# EAGLE design volume1882 (EAGLE 7.6.0)
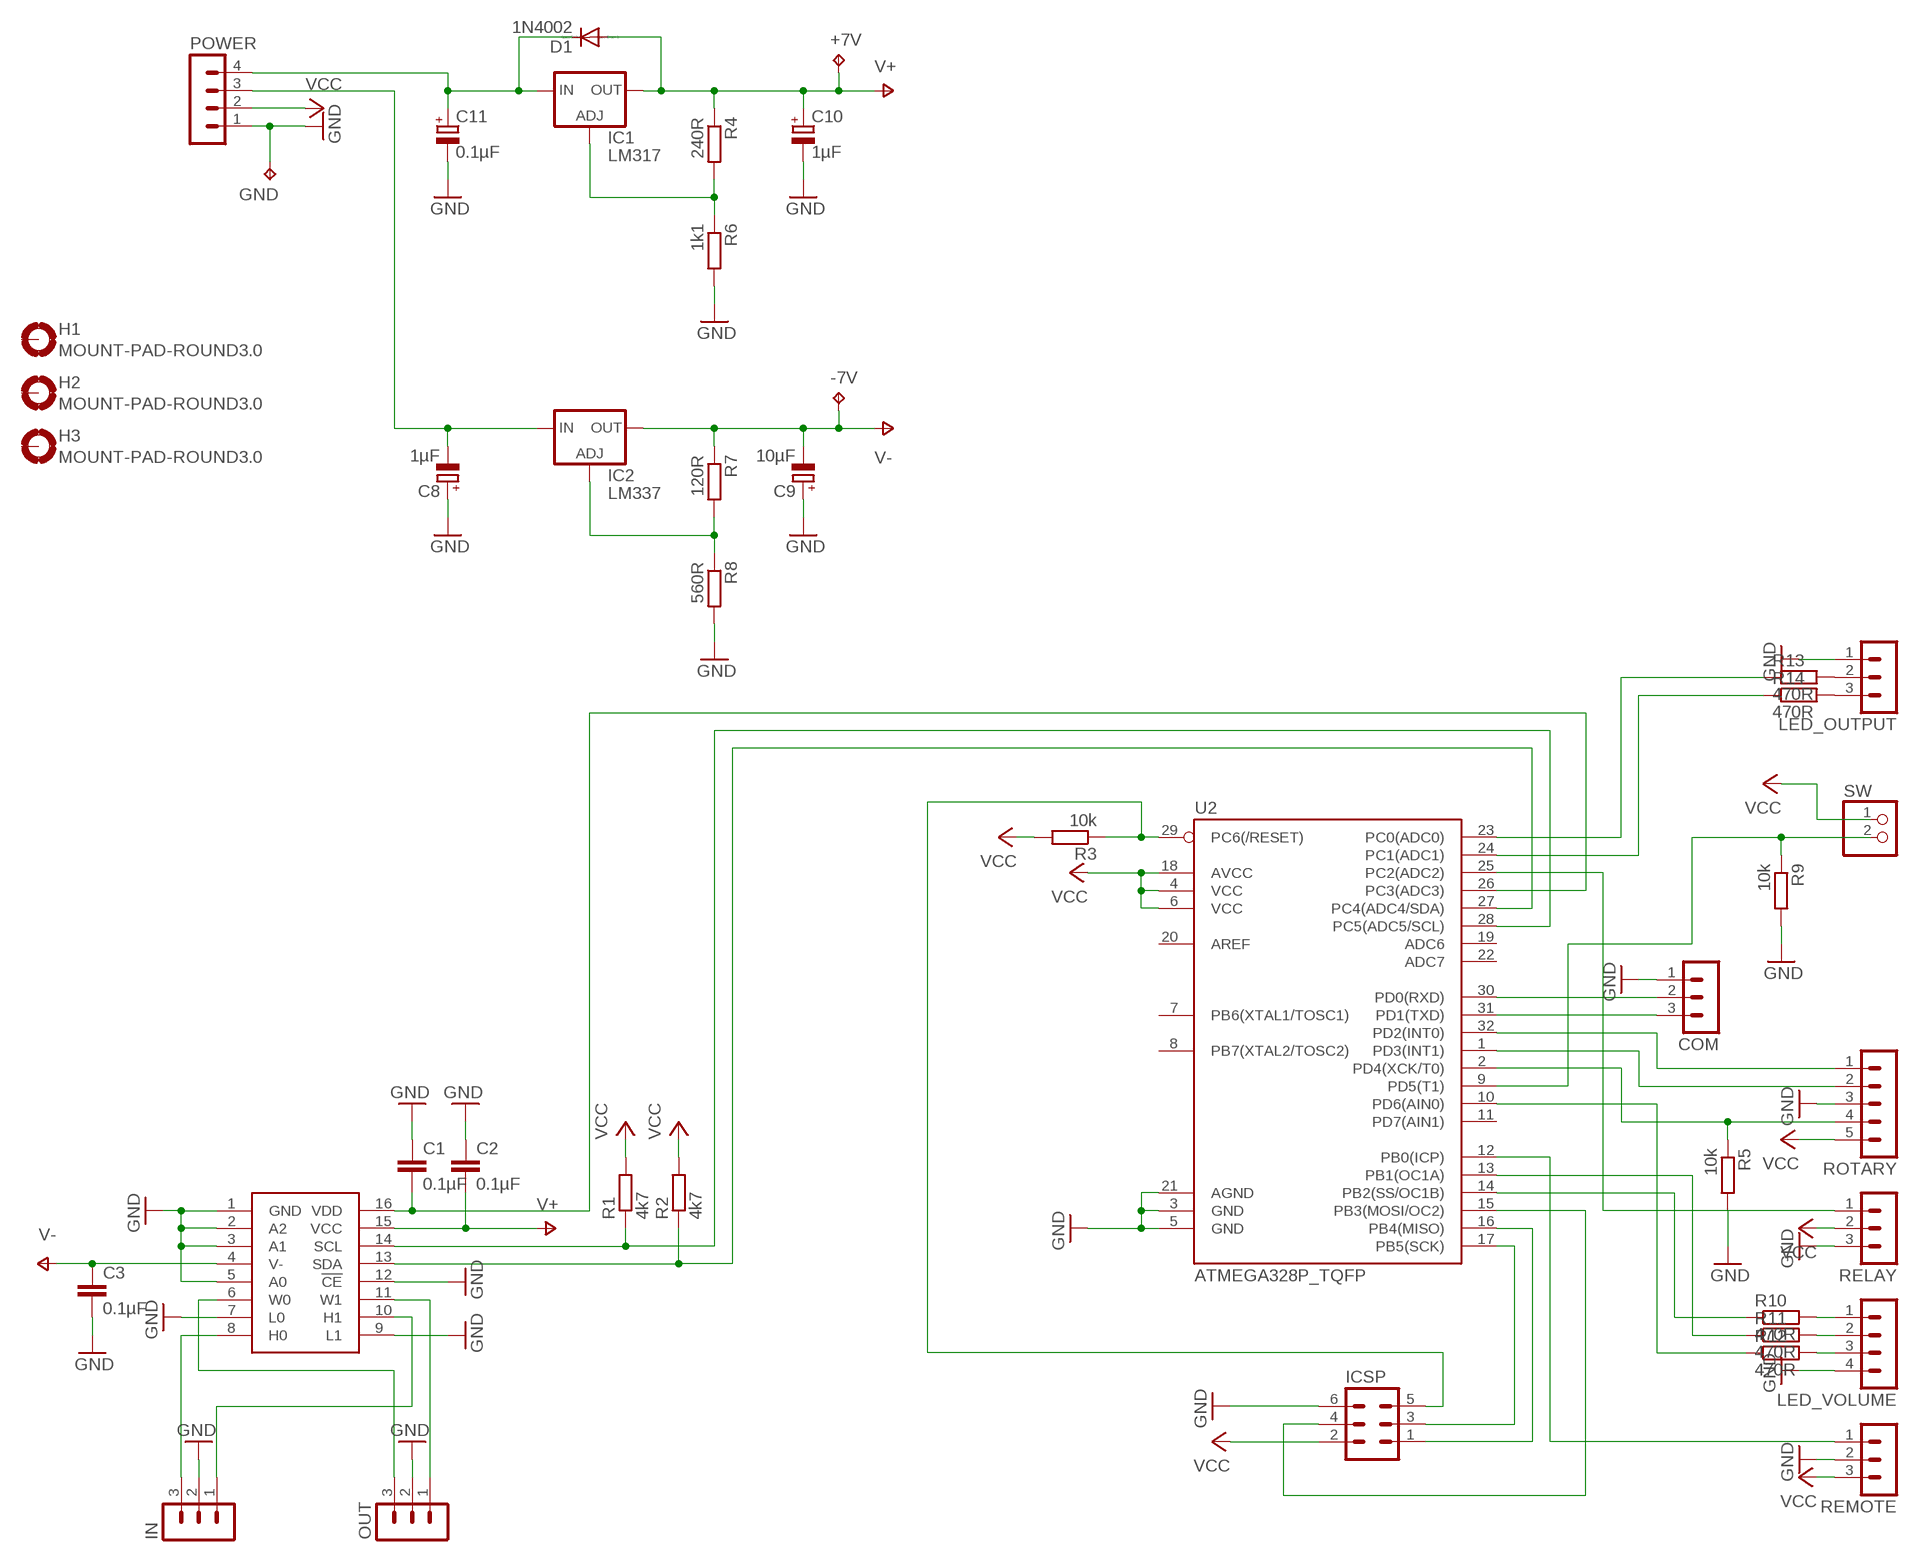
[diagram p0: schematic, sheet 1]

## Parts
+7V  TPTP12SQ  [TP12SQ]
-7V  TPTP12SQ  [TP12SQ]
C1  0.1µF  C-EUC1206  [C1206]
C2  0.1µF  C-EUC1206  [C1206]
C3  0.1µF  C-EUC1206  [C1206]
C8  1µF  CPOL-EUE2-5  [E2-5]
C9  10µF  CPOL-EUE2-5  [E2-5]
C10  1µF  CPOL-EUE2-5  [E2-5]
C11  0.1µF  CPOL-EUE2-5  [E2-5]
COM  MA03-1  [MA03-1]
D1  1N4002  1N4004  [DO41-10]
GND  TPTP12SQ  [TP12SQ]
H1  MOUNT-PAD-ROUND3.0  [3,0-PAD]
H2  MOUNT-PAD-ROUND3.0  [3,0-PAD]
H3  MOUNT-PAD-ROUND3.0  [3,0-PAD]
IC1  LM317  LM317MBSTT3  [SOT223]
IC2  LM337  [SOT223]
ICSP  MA03-2  [MA03-2]
IN  MA03-1  [MA03-1]
LED_OUTPUT  MA03-1  [MA03-1]
LED_VOLUME  MA04-1  [MA04-1]
OUT  MA03-1  [MA03-1]
POWER  MA04-1  [MA04-1]
R1  4k7  R-EU_R1206  [R1206]
R2  4k7  R-EU_R1206  [R1206]
R3  10k  R-EU_R1206  [R1206]
R4  240R  R-EU_R1206  [R1206]
R5  10k  R-EU_R1206  [R1206]
R6  1k1  R-EU_R1206  [R1206]
R7  120R  R-EU_R1206  [R1206]
R8  560R  R-EU_R1206  [R1206]
R9  10k  R-EU_R1206  [R1206]
R10  470R  R-EU_R1206  [R1206]
R11  470R  R-EU_R1206  [R1206]
R12  470R  R-EU_R1206  [R1206]
R13  470R  R-EU_R1206  [R1206]
R14  470R  R-EU_R1206  [R1206]
RELAY  MA03-1  [MA03-1]
REMOTE  MA03-1  [MA03-1]
ROTARY  MA05-1  [MA05-1]
SW  PINHD-1X2  [1X02]
U1  DS1882  [SO16]
U2  ATMEGA328P_TQFP  [TQFP32-08]

## Nets
GND: C1.1 C2.1 C3.2 C8.+ C9.+ C10.- C11.- COM.1 GND.TP ICSP.6 IN.2 LED_OUTPUT.1 LED_VOLUME.4 OUT.2 POWER.1 R5.2 R6.2 R8.2 R9.2 RELAY.3 REMOTE.2 ROTARY.3 U1.1(GND) U1.2(A2) U1.3(A1) U1.5(A0) U1.7(L0) U1.9(L1) U1.12(!CE) U2.3(GND) U2.5(GND) U2.21(AGND)
N$1: ICSP.5 R3.1 U2.29(PC6(/RESET))
N$2: ICSP.1 U2.16(PB4(MISO))
N$3: ICSP.3 U2.17(PB5(SCK))
N$4: ICSP.4 U2.15(PB3(MOSI/OC2))
N$5: R1.1 U1.14(SCL) U2.28(PC5(ADC5/SCL))
N$6: R2.1 U1.13(SDA) U2.27(PC4(ADC4/SDA))
N$7: COM.3 U2.31(PD1(TXD))
N$8: COM.2 U2.30(PD0(RXD))
N$9: ROTARY.1 U2.32(PD2(INT0))
N$10: ROTARY.2 U2.1(PD3(INT1))
N$11: R5.1 ROTARY.4 U2.2(PD4(XCK/T0))
N$12: C1.2 U1.16(VDD) U2.26(PC3(ADC3))
N$13: R11.1 U2.13(PB1(OC1A))
N$14: R10.1 U2.14(PB2(SS/OC1B))
N$15: R12.1 U2.10(PD6(AIN0))
N$16: IN.3 U1.8(H0)
N$17: IN.1 U1.10(H1)
N$18: OUT.3 U1.6(W0)
N$19: OUT.1 U1.11(W1)
N$20: C11.+ D1.C IC1.3(IN) POWER.4
N$21: C8.- IC2.2(IN) POWER.3
N$22: IC1.1(ADJ) R4.2 R6.1
N$23: R9.1 SW.2 U2.9(PD5(T1))
N$24: IC2.1(ADJ) R7.2 R8.1
N$25: RELAY.1 U2.25(PC2(ADC2))
N$26: LED_VOLUME.1 R10.2
N$27: LED_VOLUME.2 R11.2
N$28: LED_VOLUME.3 R12.2
N$29: R13.1 U2.23(PC0(ADC0))
N$30: R14.1 U2.24(PC1(ADC1))
N$31: LED_OUTPUT.2 R13.2
N$32: LED_OUTPUT.3 R14.2
N$33: REMOTE.1 U2.12(PB0(ICP))
V+: +7V.TP C2.2 C10.+ D1.A IC1.4(OUT) R4.1 U1.15(VCC)
V-: -7V.TP C3.1 C9.- IC2.3(OUT) R7.1 U1.4(V-)
VCC: ICSP.2 POWER.2 R1.2 R2.2 R3.2 RELAY.2 REMOTE.3 ROTARY.5 SW.1 U2.4(VCC) U2.6(VCC) U2.18(AVCC)
Unconnected: H1.B3,0(MOUNT) H2.B3,0(MOUNT) H3.B3,0(MOUNT) U2.7(PB6(XTAL1/TOSC1)) U2.8(PB7(XTAL2/TOSC2)) U2.11(PD7(AIN1)) U2.19(ADC6) U2.20(AREF) U2.22(ADC7)

## Library data of the parts
+7V -7V GND = testpad:TP: Test pad
C1-C3 = resistor:C-EU: CAPACITOR, European symbol
C8-C11 = resistor:CPOL-EU: POLARIZED CAPACITOR, European symbol
COM IN LED_OUTPUT OUT RELAY REMOTE = con-lstb:MA03-1: PIN HEADER; OC_FARNELL: unknown; OC_NEWARK: unknown
D1 = diode:1N4004: DIODE general purpose rectifier, 1 A
H1-H3 = holes:MOUNT-PAD-ROUND: MOUNTING PAD, round
IC1 = v-reg:LM317?*: 500 mA Adjustable Output Positive Voltage Regulator Source: http://www.onsemi.co.jp .. LM317M-D.PDF
IC2 = lm337:LM337
ICSP = con-lstb:MA03-2: PIN HEADER; OC_FARNELL: unknown; OC_NEWARK: unknown
LED_VOLUME POWER = con-lstb:MA04-1: PIN HEADER; OC_FARNELL: unknown; OC_NEWARK: unknown
R1-R14 = resistor:R-EU_: RESISTOR, European symbol
ROTARY = con-lstb:MA05-1: PIN HEADER; OC_FARNELL: unknown; OC_NEWARK: unknown
SW = pinhead:PINHD-1X2: PIN HEADER
U1 = ds1882:DS1882
U2 = SparkFun-DigitalIC:ATMEGA328P_TQFP; PROD_ID: IC-09069

## Board
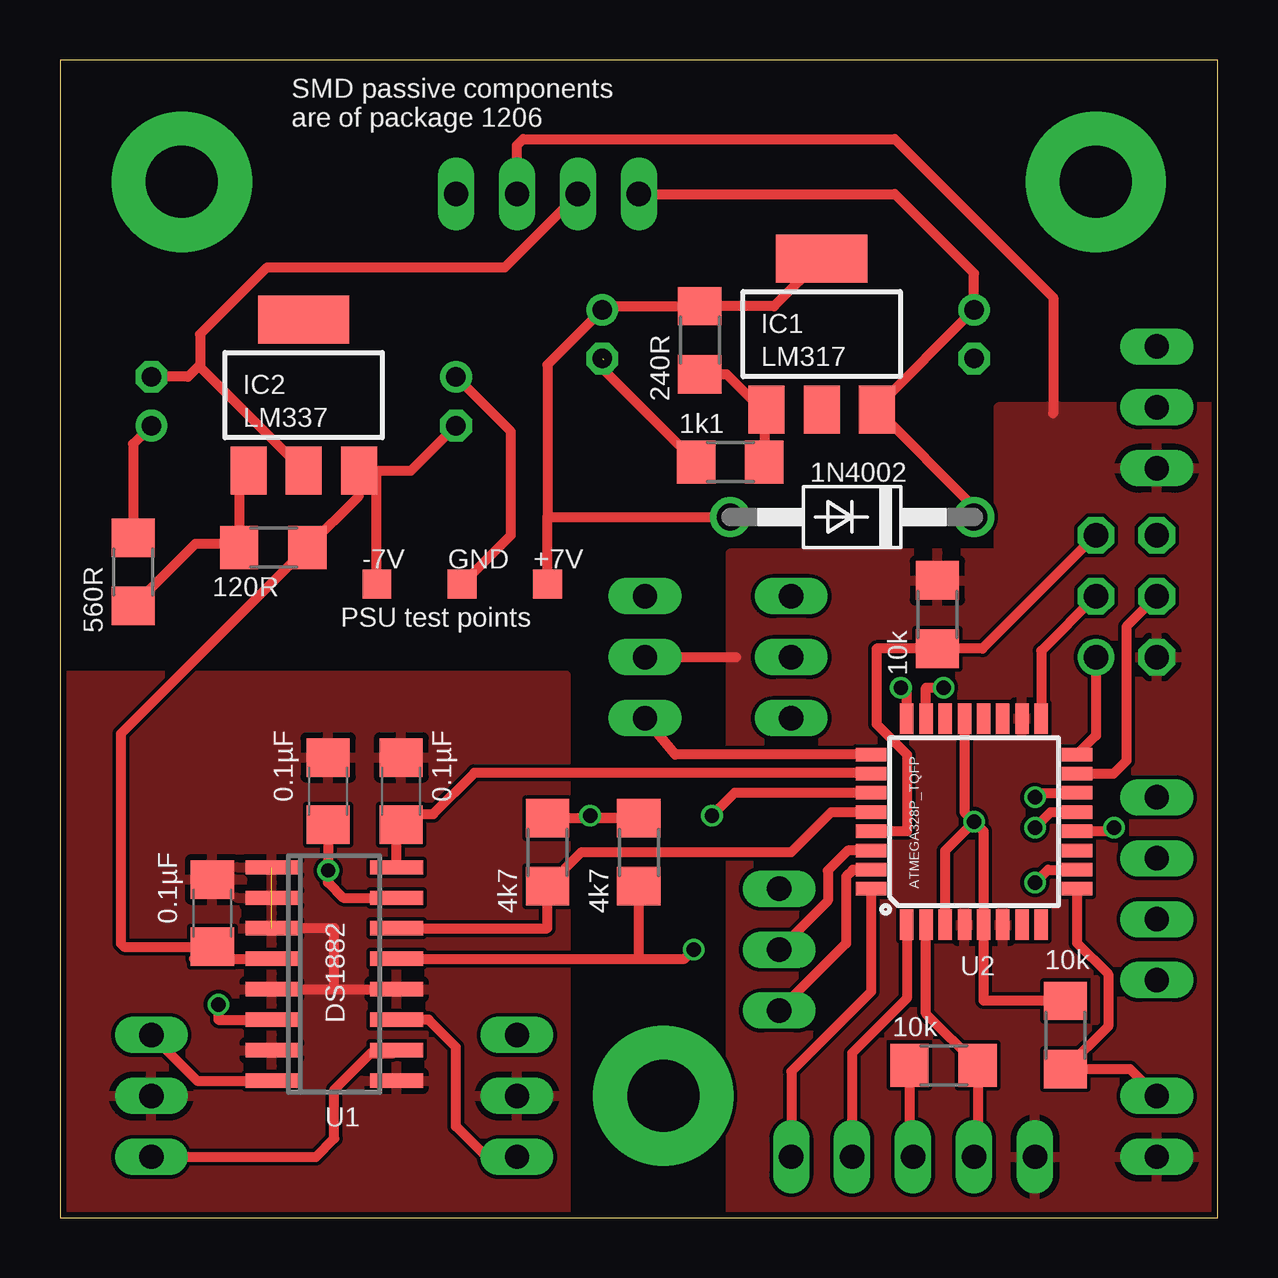
[diagram p1: board, top side]
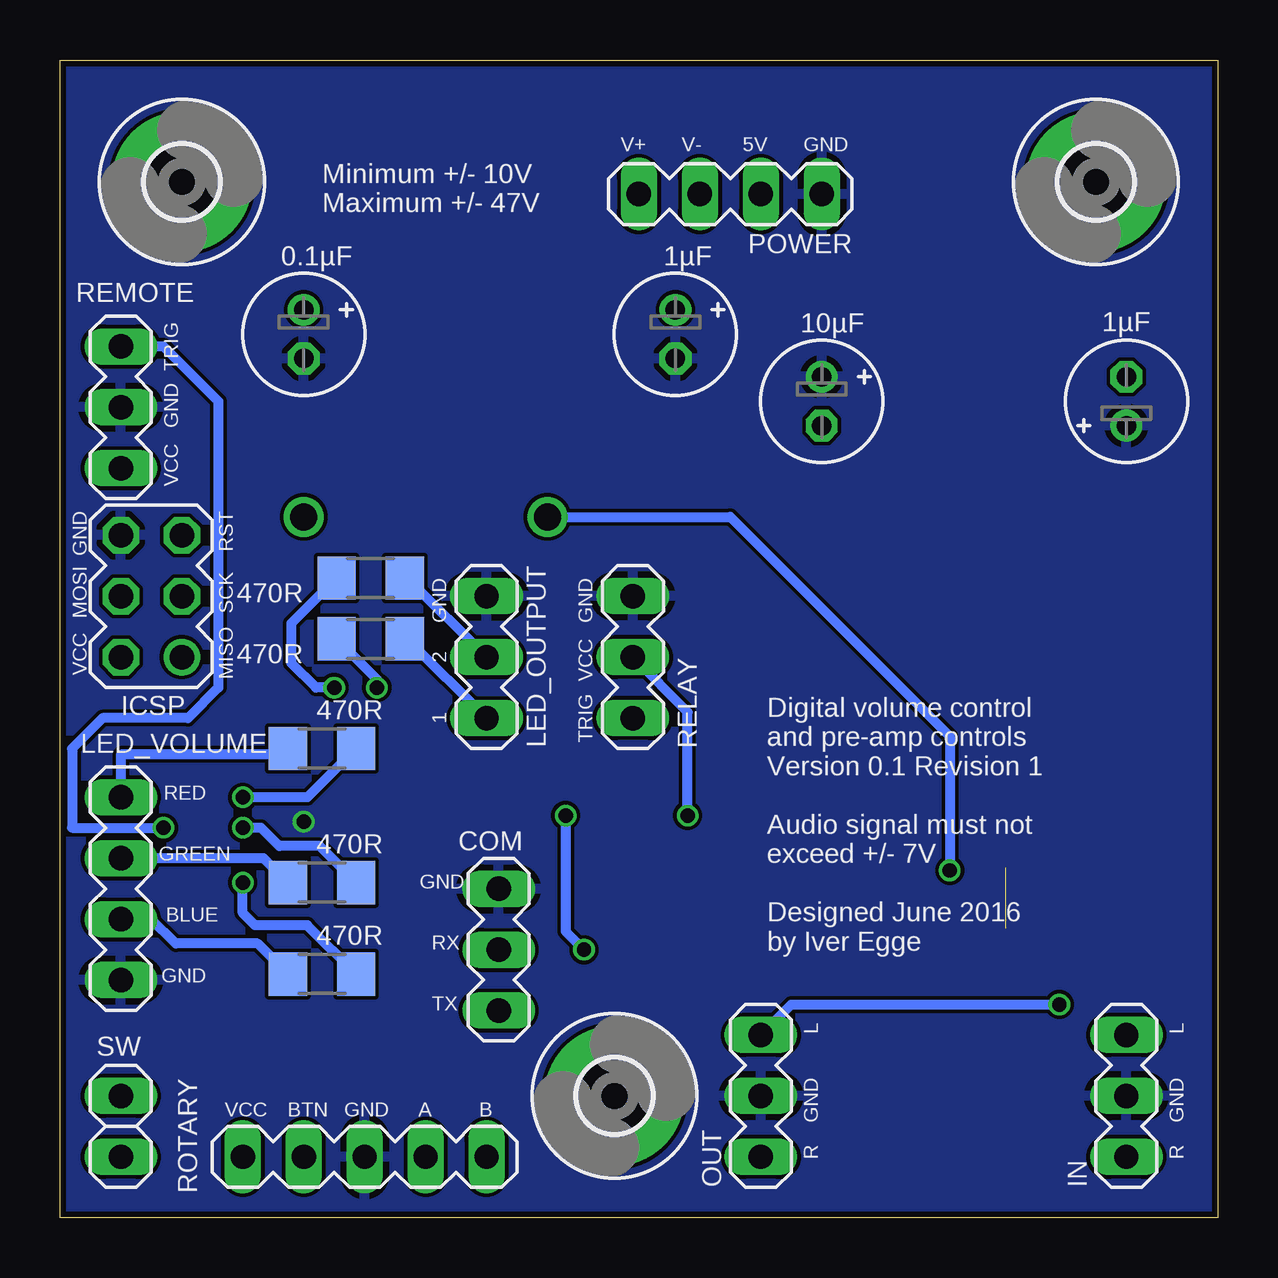
[diagram p2: board, bottom side, seen from below]

Size 48.26 x 48.26 mm. Coordinates in mm from the lower left corner, seen from the top.
Outline: 0,0 48.26,0 48.26,48.26 0,48.26 0,0
Copper layers (1*16): Top 0.035mm / dielectric 1.5mm / Bottom 0.035mm
Design rules "SeeedStudio_2layer_DRU_no_angle_20140221": minimum track width 6mil, minimum drill 12mil, track to track 6mil, track to pad 6mil, pad to pad 6mil, via to via 6mil, smd to smd 0mil, copper to edge 10mil, drill to drill 10mil, minimum pad ring 10mil, minimum via ring 6mil, stop-mask expansion 2mil, vias tented up to drill 100mil, thermal gap 10mil

### Footprints (pad centres in the part's own frame; a part is rotated, then mirrored left to right if it is on the bottom)
TP12SQ = smd 1.2 x 1.2: TP 0,0
C1206 = smd 1.6 x 1.8: 1 -1.4,0; 2 1.4,0
E2-5 = drill 0.813 pad 1.27: + -1.016,0 | drill 0.813 pad 1.27 octagon: - 1.016,0
MA03-1 = drill 1.016 long: 1 -2.54,0; 2 0,0; 3 2.54,0
DO41-10 = drill 1.118: A 5.08,0; C -5.08,0
3,0-PAD = drill 3 pad 5.842: B3,0 0,0
SOT223 = smd 1.5 x 2: 1 -2.3,-3.15; 2 0,-3.15; 3 2.3,-3.15 | smd 3.8 x 2: 4 0,3.15
MA03-2 = drill 1.016: 1 -2.54,-1.27 | drill 1.016 octagon: 2 -2.54,1.27; 3 0,-1.27; 4 0,1.27; 5 2.54,-1.27; 6 2.54,1.27
MA04-1 = drill 1.016 long: 1 -3.81,0; 2 -1.27,0; 3 1.27,0; 4 3.81,0
R1206 = smd 1.6 x 1.803: 1 -1.422,0; 2 1.422,0
MA05-1 = drill 1.016 long: 1 -5.08,0; 2 -2.54,0; 3 0,0; 4 2.54,0; 5 5.08,0
1X02 = drill 1.016 long: 1 -1.27,0; 2 1.27,0
SO16 = smd 0.6 x 2.2: 1 -4.445,-2.6; 2 -3.175,-2.6; 3 -1.905,-2.6; 4 -0.635,-2.6; 5 0.635,-2.6; 6 1.905,-2.6; 7 3.175,-2.6; 8 4.445,-2.6; 9 4.445,2.6; 10 3.175,2.6; 11 1.905,2.6; 12 0.635,2.6; 13 -0.635,2.6; 14 -1.905,2.6; 15 -3.175,2.6; 16 -4.445,2.6
TQFP32-08 = smd 1.27 x 0.559: 1 -4.293,2.8; 2 -4.293,2; 3 -4.293,1.2; 4 -4.293,0.4; 5 -4.293,-0.4; 6 -4.293,-1.2; 7 -4.293,-2; 8 -4.293,-2.8; 17 4.293,-2.8; 18 4.293,-2; 19 4.293,-1.2; 20 4.293,-0.4; 21 4.293,0.4; 22 4.293,1.2; 23 4.293,2; 24 4.293,2.8 | smd 0.559 x 1.27: 9 -2.8,-4.293; 10 -2,-4.293; 11 -1.2,-4.293; 12 -0.4,-4.293; 13 0.4,-4.293; 14 1.2,-4.293; 15 2,-4.293; 16 2.8,-4.293; 25 2.8,4.293; 26 2,4.293; 27 1.2,4.293; 28 0.4,4.293; 29 -0.4,4.293; 30 -1.2,4.293; 31 -2,4.293; 32 -2.8,4.293

### Placement (x,y rotation side)
+7V  20.32,26.42 0 top
-7V  13.21,26.42 0 top
C1  14.22,17.78 270 top
C2  11.18,17.78 270 top
C3  6.35,12.7 90 top
C8  3.81,34.04 90 bottom
C9  16.51,34.04 270 bottom
C10  22.61,36.83 270 bottom
C11  38.1,36.83 270 bottom
COM  29.97,11.18 270 bottom
D1  33.02,29.21 180 top
GND  16.76,26.42 0 top
H1  25.15,5.08 0 bottom
H2  43.18,43.18 0 bottom
H3  5.08,43.18 0 bottom
IC1  31.75,36.83 0 top
IC2  10.16,34.29 0 top
ICSP  44.45,25.91 90 bottom
IN  3.81,5.08 90 bottom
LED_OUTPUT  30.48,23.37 270 bottom
LED_VOLUME  45.72,13.72 270 bottom
OUT  19.05,5.08 90 bottom
POWER  20.32,42.67 180 bottom
R1  20.32,15.24 90 top
R2  24.13,15.24 90 top
R3  36.58,25.15 90 top
R4  26.67,36.58 270 top
R5  36.83,6.35 180 top
R6  27.94,31.5 180 top
R7  8.89,27.94 180 top
R8  3.05,26.92 90 top
R9  41.91,7.62 90 top
R10  37.34,19.56 180 bottom
R11  37.34,13.97 180 bottom
R12  37.34,10.16 180 bottom
R13  35.31,26.67 0 bottom
R14  35.31,24.13 0 bottom
RELAY  24.38,23.37 90 bottom
REMOTE  45.72,33.78 270 bottom
ROTARY  35.56,2.54 180 bottom
SW  45.72,3.81 90 bottom
U1  11.43,10.16 270 top
U2  38.1,16.51 90 top

### Tracks (layer width: path | path; a pad name or v marks a point on that pad's centre or on a via)
GND  (via drill 0.6 pad 0.25)  (2 unrouted)
  Top 0.406: U1.5 11.43,9.53 | 11.43,9.53 11.43,12.06 U1.3 | 11.43,9.53 U1.12 | U2.21 37.7,16.91 v38.1,16.51 | v38.1,16.51 38.5,16.11 U2.5 38.5,9.04 R9.2 | U2.3 36.9,15.31 v38.1,16.51 | R5.2 35.41,2.69 ROTARY.3 | GND.TP 18.8,28.45 18.8,32.77 C9.+ | C8.+ 3.05,32.26 R8.2 | 22.66,35.76 22.66,35.36 R6.2
  pour Bottom: 0,0 48.26,0 48.26,48.26 0,48.26
  pour Top: 0,22.61 21.08,22.61 21.08,-0.25 0,-0.25
N$1
  Top 0.406: U2.29 35.31,16.11 35.31,19.3 34.04,20.57 34.04,23.72 R3.1 38.46,23.72 ICSP.5
N$2
  Top 0.406: ICSP.1 43.18,20.1 U2.16
N$3
  Top 0.406: ICSP.3 40.9,23.63 U2.17
N$4
  Top 0.406: ICSP.4 44.45,24.64 44.45,19.05 43.91,18.51 U2.15
N$5
  Top 0.406: U1.14 20.32,12.06 R1.1 21.74,15.24 30.48,15.24 32.15,16.91 U2.28
N$6  (via drill 0.6 pad 0.25)
  Top 0.406: U1.13 24.13,10.79 | 24.13,10.79 R2.1 | U2.27 28.12,17.71 v27.18,16.76 | 24.13,10.79 26.04,10.79 v26.42,11.18
  Bottom 0.406: v27.18,16.76 27.18,11.94 v26.42,11.18
N$7
  Top 0.406: U2.31 33.05,14.51 32.77,14.22 32.77,11.43 COM.3
N$8
  Top 0.406: U2.30 32.84,15.31 32,14.48 32,13.21 COM.2
N$9
  Top 0.406: U2.32 33.81,9.42 30.48,6.1 ROTARY.1
N$10
  Top 0.406: U2.1 35.3,9.14 33.02,6.86 ROTARY.2
N$11
  Top 0.406: U2.2 36.1,8.5 R5.1 38.25,2.69 ROTARY.4
N$12
  Top 0.406: U2.26 33.77,18.54 17.27,18.54 15.56,16.83 14.03,16.83 arc90 C1.2 14.03,16.19 U1.16
N$13  (via drill 0.6)
  Top 0.406: v40.64,16.26 41.29,16.91 U2.13
  Bottom 0.406: R11.1 37.44,15.49 39.12,15.49 39.88,16.26 v40.64,16.26
N$14  (via drill 0.6 pad 0.25)
  Top 0.406: v40.64,17.53 40.82,17.71 U2.14
  Bottom 0.406: R10.1 37.95,17.53 v40.64,17.53
N$15  (via drill 0.6)
  Top 0.406: v40.64,13.97 41.18,14.51 U2.10
  Bottom 0.406: R12.1 37.95,12.19 40.13,12.19 40.64,12.7 v40.64,13.97
N$16
  Top 0.406: IN.3 5.71,5.71 U1.8
N$17
  Top 0.406: U1.10 13.9,6.86 12.95,6.86 11.43,5.33 11.43,3.3 10.67,2.54 IN.1
N$18  (via drill 0.6 pad 0.25)
  Top 0.406: U1.6 6.6,8.26 v6.6,8.89
  Bottom 0.406: OUT.3 17.78,8.89 v6.6,8.89
N$19
  Top 0.406: OUT.1 17.78,2.54 16.51,3.81 16.51,7.11 15.37,8.26 U1.11
N$20
  Top 0.406: D1.C 38.1,29.63 IC1.3 34.05,33.8 C11.+ 38.1,39.37 34.8,42.67 POWER.4
N$21
  Top 0.406: POWER.3 18.54,39.62 8.64,39.62 5.84,36.83 5.84,35.56 | 5.84,35.56 5.84,35.46 IC2.2 | 5.84,35.56 5.33,35.05 C8.-
N$22
  Top 0.406: IC1.1 29.36,33.59 | 29.36,33.59 R6.1 | 29.36,33.59 27.8,35.15 R4.2
N$23
  Top 0.406: U2.9 42.39,11.46 43.69,10.16 43.69,7.98 R9.1 44.6,6.2 SW.2
N$24
  Top 0.406: IC2.1 7.47,30.75 R7.2 7.32,28.09 5.64,28.09 R8.1
N$25
  Top 0.406: U2.25 25.65,19.31 RELAY.1
N$26
  Bottom 0.406: R10.2 39.01,19.3 45.72,19.3 LED_VOLUME.1
N$27
  Bottom 0.406: R11.2 39.78,14.99 LED_VOLUME.2
N$28
  Bottom 0.406: R12.2 40.03,11.43 43.43,11.43 44.45,12.45 LED_VOLUME.3
N$29  (via drill 0.6 pad 0.25)
  Top 0.406: U2.23 36.1,22.1 v36.83,22.1
  Bottom 0.406: v36.83,22.1 37.59,22.1 38.61,23.11 38.61,24.79 R13.1
N$30  (via drill 0.6 pad 0.25)
  Top 0.406: U2.24 35.3,22.09 v35.05,22.1
  Bottom 0.406: v35.05,22.1 35.05,22.45 R14.1
N$31
  Bottom 0.406: R13.2 33.78,26.67 LED_OUTPUT.2
N$32
  Bottom 0.406: R14.2 33.78,24.13 LED_OUTPUT.3
N$33  (via drill 0.6 pad 0.25)
  Top 0.406: v43.94,16.26 43.8,16.11 U2.12
  Bottom 0.406: v43.94,16.26 47.75,16.26 47.75,19.56 46.48,20.83 42.93,20.83 41.66,22.1 41.66,34.04 43.94,36.32 REMOTE.1
V+  (via drill 0.6 pad 0.3)
  Top 0.406: U1.15 11.81,13.34 11.18,13.97 v11.18,14.48 C2.2 | +7V.TP 20.32,29.21 | 20.32,29.21 D1.A | IC1.4 29.77,38 R4.1 | R4.1 26.52,37.85 | 20.32,29.21 20.32,35.56 C10.+ 22.76,38 R4.1
  Bottom 0.406: D1.A 20.32,29.21 11.18,20.07 v11.18,14.48
V-
  Top 0.406: U1.4 5.58,10.79 C3.1 2.67,11.3 2.54,11.43 2.54,20.17 R7.1 12.46,30.09 IC2.3 13.21,31.14 | -7V.TP 13.21,31.14 | 13.21,31.14 14.63,31.14 C9.-
VCC  (via drill 0.6 pad 0.25)
  Top 0.406: R1.2 R2.2 22.2,16.66 v22.1,16.76 | POWER.2 19.05,44.7 19.3,44.96 34.8,44.96 41.4,38.35 41.4,33.53 | RELAY.2 28.19,23.37
  Bottom 0.406: v22.1,16.76 22.1,21.08 RELAY.2
  pour Top: 39.12,33.78 39.12,27.69 27.94,27.69 27.94,0 48.26,0 48.26,33.78

### Text on the board
tPlace: SMD passive components / are of package 1206 | PSU test points
bPlace: GND | 5V | V- | V+ | Minimum +/- 10V / Maximum +/- 47V | TRIG | GND | VCC | RST | GND | GND | GND | SCK | MOSI | MISO | VCC | 2 | VCC | TRIG | 1 | RED | GREEN | GND | BLUE | RX | Digital volume control / and pre-amp controls / Version 0.1 Revision 1 / / Audio signal must not / exceed +/- 7V / / Designed June 2016 / by Iver Egge | GND | TX | L | L | GND | GND | B | A | GND | BTN | VCC | R | R